# Altium schematic sheet SCH.SchDoc
size B; SheetNumber: 1; SheetTotal: 1
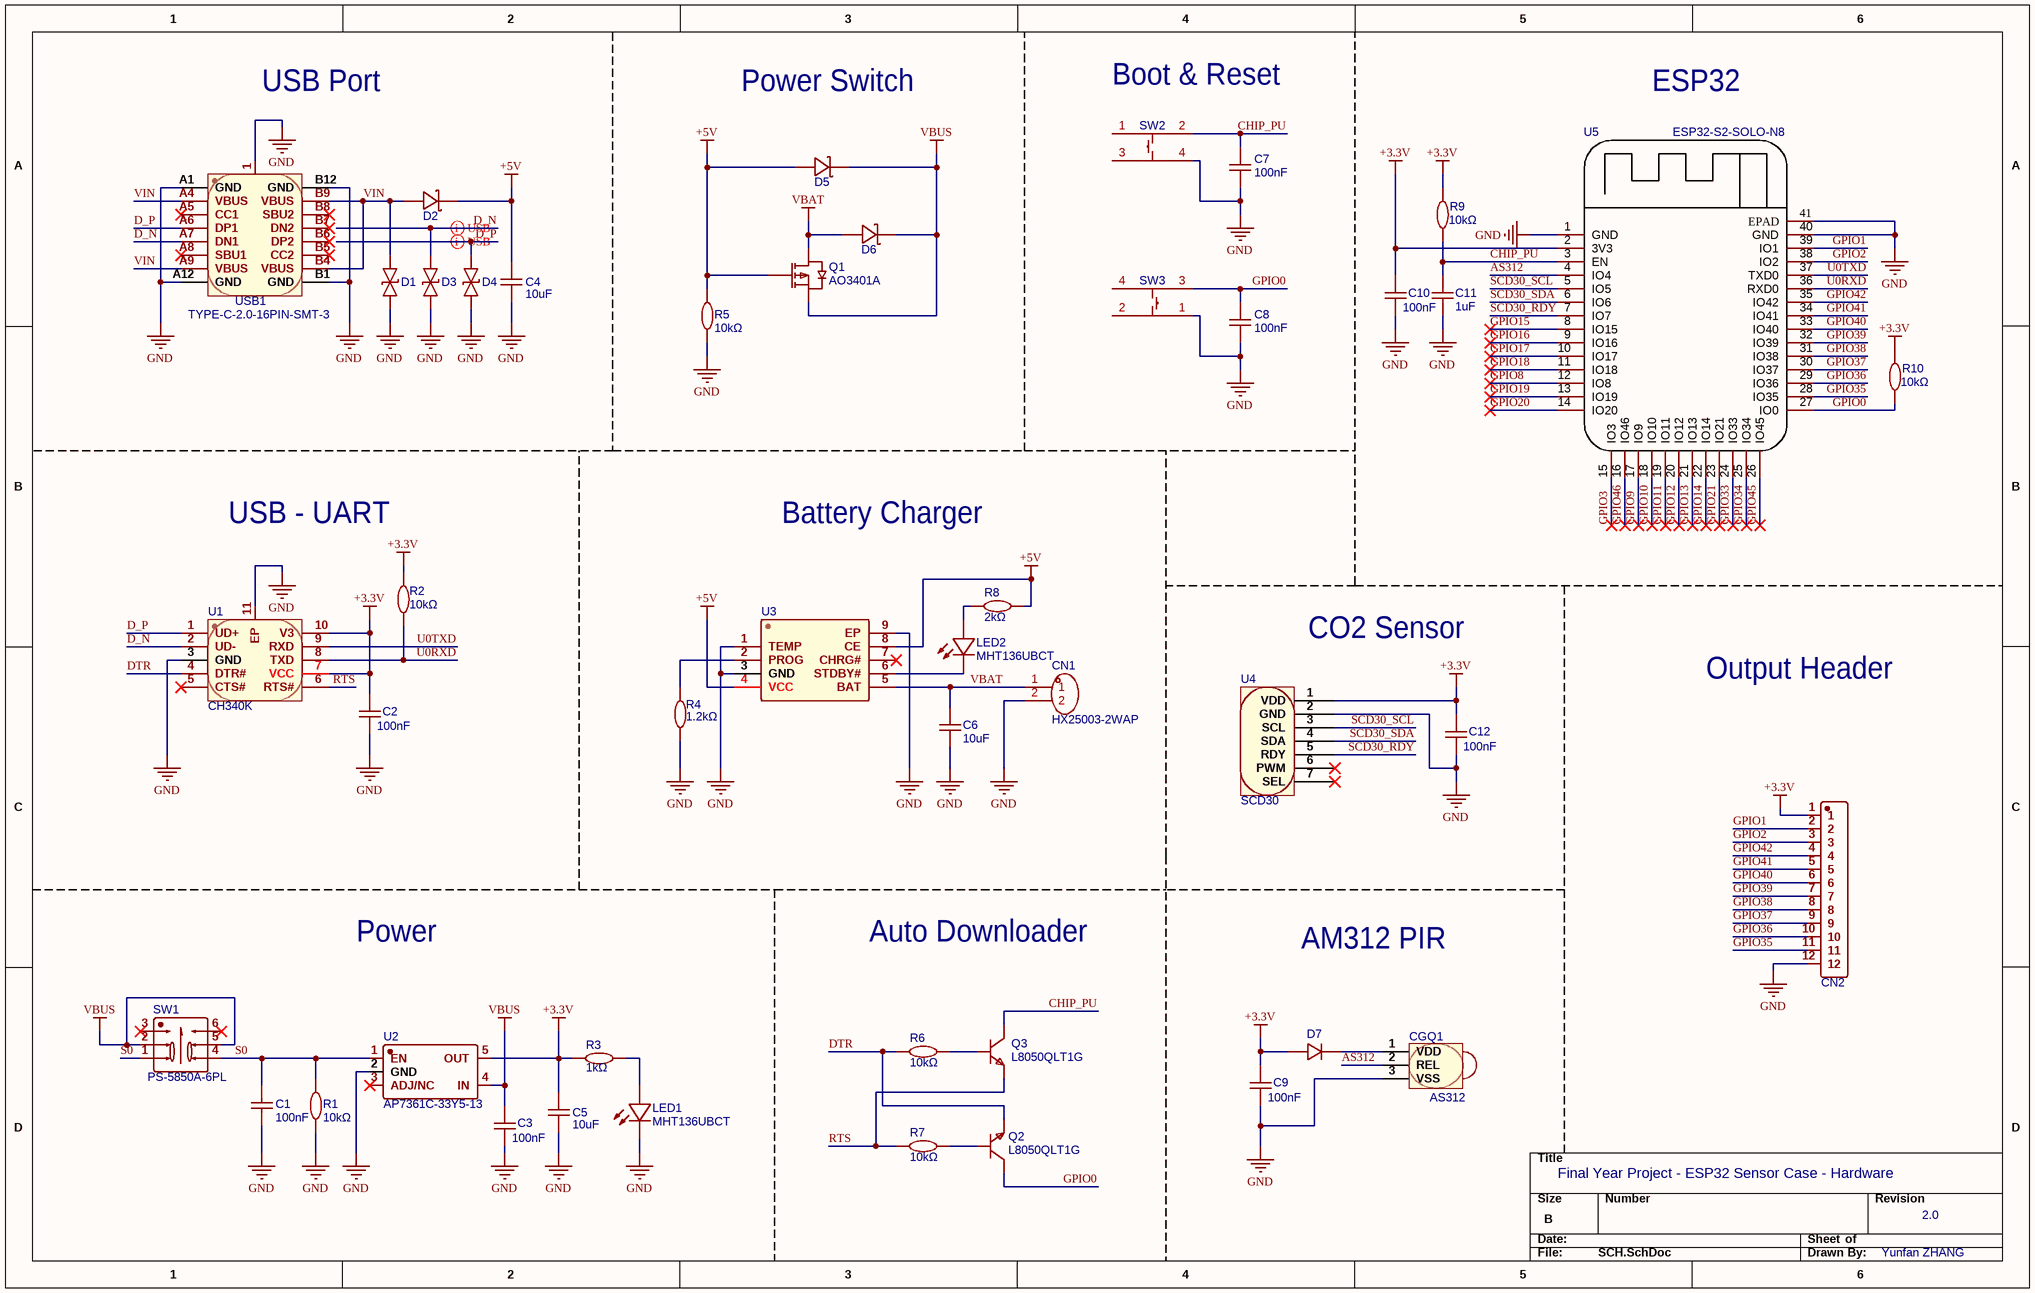
[diagram p0: SCH.SchDoc]

## Parts
C1  100nF  [C0603]
C2  100nF  [C0603]
C3  100nF  [C0603]
C4  10uF  [C0805]
C5  10uF  [C0805]
C6  10uF  [C0805]
C7  100nF  [C0603]
C8  100nF  [C0603]
C9  100nF  [C0603]
C10  100nF  [C0603]
C11  1uF  [C0603]
C12  100nF  [C0603]
CGQ1  AS312  [AS312]
CN1  HX25003-2WAP  [Conn - XH2.54_2P_W]
CN2  X4611WV-12I-C28D40  [Conn - Header_P2.00mm_1*12p_V]  (value not drawn)
D1  LESD5D5.0CT1G  [SOD-523]  (value not drawn)
D2  1N5819HW-7-F  [SOD-123]  (value not drawn)
D3  LESD5D5.0CT1G  [SOD-523]  (value not drawn)
D4  LESD5D5.0CT1G  [SOD-523]  (value not drawn)
D5  1N5819HW-7-F  [SOD-123]  (value not drawn)
D6  1N5819HW-7-F  [SOD-123]  (value not drawn)
D7  CUS08F30,H3F  [SOD-323F]  (value not drawn)
LED1  Name: MHT136UBCT  [LED0402]  (hidden comment: anufacturer Part)
LED2  Name: MHT136UBCT  [LED0402]  (hidden comment: anufacturer Part)
Q1  AO3401A  [SOT-23]
Q2  L8050QLT1G  [SOT-23-3]
Q3  L8050QLT1G  [SOT-23-3]
R1  10kΩ  [R0603]
R2  10kΩ  [R0603]
R3  1kΩ  [R0603]
R4  1.2kΩ  [R0603]
R5  10kΩ  [R0603]
R6  10kΩ  [R0603]
R7  10kΩ  [R0603]
R8  2kΩ  [R0603]
R9  10kΩ  [R0603]
R10  10kΩ  [R0603]
SW1  PS-5850A-6PL  [SW-TH_6P-L5.8-W5.8]
SW2  TD-1150SR-3.8H-250  [SW-PB_SMD_L4.5W4.5]  (value not drawn)
SW3  TD-1150SR-3.8H-250  [SW-PB_SMD_L4.5W4.5]  (value not drawn)
U1  CH340K  [ESOP-10]
U2  AP7361C-33Y5-13  [SOT-89-5]
U3  TP4056  [ESOP-8]  (value not drawn)
U4  SCD30  [SCD30]
U5  ESP32-S2-SOLO-N8  [ESP32-S2-SOLO]
USB1  TYPE-C-2.0-16PIN-SMT-3  [TYPE-C-SMD_TYPE-CF3.1]

## Nets
+3.3V: C2.2 C5.1 C9.2 C10.2 C12.2 CN2.1 D7.2(A) R2.2 R3.1 R9.2 R10.2 U1.7(VCC) U1.10(V3) U2.5(OUT) U4.1(VDD) U5.2(3V3)
+5V: C4.1 D2.2(K) D5.1(A) Q1.1(G) R5.2 R8.2 U3.4(VCC) U3.8(CE)
GND: C1.1 C2.1 C3.1 C4.2 C5.2 C6.1 C7.1 C8.1 C9.1 C10.1 C11.1 C12.1 CGQ1.3(VSS) CN1.2 CN2.12 D1.1 D3.1 D4.1 LED1.1(K) R1.1 R4.1 R5.1 SW2.4 SW3.1 U1.3(GND) U1.11(EP) U2.2(GND) U3.1(TEMP) U3.3(GND) U3.9(EP) U4.2(GND) U5.1(GND) U5.40(GND) U5.41(EPAD) USB1.1(EH) USB1.A1(GND) USB1.A12(GND) USB1.B1(GND) USB1.B12(GND)
VBAT: C6.2 CN1.1 D6.1(A) Q1.3(D) U3.5(BAT)
VBUS: C3.2 D5.2(K) D6.2(K) Q1.2(S) SW1.2 SW1.5 U2.4(IN)
AS312: CGQ1.2(REL) U5.4(IO4)
CHIP_PU: C7.2 C11.2 Q3.3(C) R9.1 SW2.2 U5.3(EN)
D_N: D3.2 U1.2(UD-) USB1.A7(DN1)
D_P: D4.2 U1.1(UD+) USB1.A6(DP1)
DTR: Q2.2(E) R6.1 U1.4(DTR#)
GPIO0: C8.2 Q2.3(C) R10.1 SW3.3 U5.27(IO0)
GPIO1: CN2.2 U5.39(IO1)
GPIO2: CN2.3 U5.38(IO2)
GPIO3: U5.15(IO3)
GPIO8: U5.12(IO8)
GPIO9: U5.17(IO9)
GPIO10: U5.18(IO10)
GPIO11: U5.19(IO11)
GPIO12: U5.20(IO12)
GPIO13: U5.21(IO13)
GPIO14: U5.22(IO14)
GPIO15: U5.8(IO15)
GPIO16: U5.9(IO16)
GPIO17: U5.10(IO17)
GPIO18: U5.11(IO18)
GPIO19: U5.13(IO19)
GPIO20: U5.14(IO20)
GPIO21: U5.23(IO21)
GPIO33: U5.24(IO33)
GPIO34: U5.25(IO34)
GPIO35: CN2.11 U5.28(IO35)
GPIO36: CN2.10 U5.29(IO36)
GPIO37: CN2.9 U5.30(IO37)
GPIO38: CN2.8 U5.31(IO38)
GPIO39: CN2.7 U5.32(IO39)
GPIO40: CN2.6 U5.33(IO40)
GPIO41: CN2.5 U5.34(IO41)
GPIO42: CN2.4 U5.35(IO42)
GPIO45: U5.26(IO45)
GPIO46: U5.16(IO46)
RTS: Q3.2(E) R7.1 U1.6(RTS#)
S0: C1.2 R1.2 SW1.1 SW1.4 U2.1(EN)
SCD30_RDY: U4.5(RDY) U5.7(IO7)
SCD30_SCL: U4.3(SCL) U5.5(IO5)
SCD30_SDA: U4.4(SDA) U5.6(IO6)
U0RXD: R2.1 U1.8(TXD) U5.36(RXD0)
U0TXD: U1.9(RXD) U5.37(TXD0)
VIN: D1.2 D2.1(A) USB1.A4(VBUS) USB1.A9(VBUS) USB1.B4(VBUS) USB1.B9(VBUS)
NetCGQ1_1: CGQ1.1(VDD) D7.1(C)
NetLED1_2: LED1.2(A) R3.2
NetLED2_1: LED2.1(K) U3.6(STDBY#)
NetLED2_2: LED2.2(A) R8.1
NetQ2_1: Q2.1(B) R7.2
NetQ3_1: Q3.1(B) R6.2
NetR4_2: R4.2 U3.2(PROG)

Not connected (* = marked no-connect by the designer): SW1 3* 6*; SW2 1 3; SW3 2 4; U1 5(CTS#)*; U2 3(ADJ/NC)*; U3 7(CHRG#)*; U4 6(PWM)* 7(SEL)*; USB1 A5(CC1)* A8(SBU1)* B5(CC2)* B6(DP2)* B7(DN2)* B8(SBU2)*

## Layout directives
differential pair: D_N, D_P

## Notes on the sheet
- USB Port
- Power Switch
- (near SW2) Boot & Reset
- ESP32
- USB - UART
- Battery Charger
- CO2 Sensor
- Output Header
- Power
- Auto Downloader
- AM312 PIR
- Final Year Project - ESP32 Sensor Case - Hardware
- 2.0
- Yunfan ZHANG

## Library data of the parts
C1-C3 C7-C10 C12 = C 100nF 0603 - CC0603KRX7R9BB104: 容值:100nF;精度:±10%;额定电压:50V;材质(温度系数):X7R;; Manufacturer: YAGEO(国巨); Add into BOM: yes; Tolerance: ±10%; Voltage Rated: 50V; Temperature Coefficient: X7R; Symbol: CC0603KRX7R9BB104; Device: CC0603KRX7R9BB104; LCSC Part Name: 100nF ±10% 50V; Supplier Part: C14663; Manufacturer Part: CC0603KRX7R9BB104; Supplier Footprint: 0603; JLCPCB Part Class: Basic Part; Datasheet: https://atta.szlcsc.com/upload/public/pdf/source/20170116/1484561234239.pdf; Supplier: LCSC; Convert to PCB: yes; Value: 100nF
  C2 C3 C9 C10 C12: Name: 100nF
C4-C6 = C 10uF 0805 - CC0805KKX5R8BB106: 容值:10uF;精度:±10%;额定电压:25V;材质(温度系数):X5R;; Manufacturer: YAGEO(国巨); Symbol: CC0805KKX5R8BB106_C694803; Add into BOM: yes; Tolerance: ±10%; Voltage Rated: 25V; Temperature Coefficient: X5R; Device: CC0805KKX5R8BB106; LCSC Part Name: 10uF ±10% 25V; Supplier Part: C694803; Manufacturer Part: CC0805KKX5R8BB106; Supplier Footprint: 0805; JLCPCB Part Class: Extended Part; Datasheet: https://atta.szlcsc.com/upload/public/pdf/source/20200629/C694803_9DB3A764988BBFF394BBC6FE6146EEC3.pdf; Supplier: LCSC; Convert to PCB: yes; Value: 10uF
  C4 C5: Name: 10uF
C11 = C 1uF 0603 - CC0603KRX5R8BB105: 容值:1uF;精度:±10%;额定电压:25V;材质(温度系数):X5R;; Manufacturer: YAGEO(国巨); Add into BOM: yes; Tolerance: ±10%; Voltage Rated: 25V; Temperature Coefficient: X5R; Symbol: CC0603KRX5R8BB105; Device: CC0603KRX5R8BB105; LCSC Part Name: 1uF ±10% 25V; Supplier Part: C14664; Manufacturer Part: CC0603KRX5R8BB105; Supplier Footprint: 0603; JLCPCB Part Class: Extended Part; Datasheet: https://atta.szlcsc.com/upload/public/pdf/source/20160606/1465200209684.pdf; Supplier: LCSC; Convert to PCB: yes; Value: 1uF; Name: 1uF
CGQ1 = AS312: 直接数字信号输出智能人体热释电红外传感器; Manufacturer: 森霸; Add into BOM: yes; Symbol: AS312; Device: AS312; LCSC Part Name: AS312; Supplier Part: C90465; Manufacturer Part: AS312; Supplier Footprint: Through Hole; JLCPCB Part Class: Extended Part; Datasheet: https://atta.szlcsc.com/upload/public/pdf/source/20200426/C410378_E662E343D148296728FA1A532A92CD1E.pdf; Supplier: LCSC; Convert to PCB: yes
CN1 = Conn - XH2.54_2P: 参考系列:XH;间距:2.5mm;插针结构:1x2P;排数:1;每排PIN数:2;行距:-;公母:公型插针;安装方式:弯插;额定电流:-;工作温度范围:-;; Manufacturer: HX(红星); Add into BOM: yes; Reference Series: XH; Pitch: 2.5mm; Pins Structure: 1x2P; Number of PINs Per Row: 2; Gender: 公型插针; Symbol: HX25003-2WAP; Device: HX25003-2WAP; LCSC Part Name: 母座 弯插/弯针 2.5mm 2Pin位; Supplier Part: C442326; Manufacturer Part: HX25003-2WAP; Supplier Footprint: 插件,P=2.5mm; JLCPCB Part Class: Extended Part; Datasheet: https://atta.szlcsc.com/upload/public/pdf/source/20191028/C442326_951D1FF48F4BC139C99E649B2A876D28.pdf; Supplier: LCSC; Convert to PCB: yes; Number of Rows: 1; Row Spacing: -; Mounting Style: 弯插; Current Rating (Max): -; Operating Temperature Range: -
CN2 = Conn - Header_P2.00mm_1*12p: 间距:2mm;总PIN位数:12;排数:1;插针结构:1x12P;行距:-;安装类型:直插;圆针/方针:方针;额定电流:3A;额定电压:250V;配合针长度:4mm;塑高:2mm;端接针长度:2.8mm;触头材质:黄铜;触头镀层:金;工作温度范围:-40~+105;焊接温度(最大值):260;颜色:黑色;; Manufacturer: XKB Connectivity(中国星坤); Add into BOM: yes; Pitch: 2mm; Pin Structure: 1x12P; Circluar Pins/Square Pins: 方针; Current Rating (Max): 3A; Voltage Rating (Max): 250V; Welding Temperature (Max): 260; Symbol: X4611WV-12I-C28D40; Device: X4611WV-12I-C28D40; LCSC Part Name: 2mm 1x12P 直插 方针; Supplier Part: C2882986; Manufacturer Part: X4611WV-12I-C28D40; Supplier Footprint: 插件,P=2mm; JLCPCB Part Class: Extended Part; Datasheet: https://atta.szlcsc.com/upload/public/pdf/source/20211011/3B1C644FF3C000A91027C44B177FF3A1.pdf; Supplier: LCSC; Convert to PCB: yes; Number of Pins: 12; Number of Rows: 1; Row Spacing: -; Mounting Type: 直插; Length of Mating Pin: 4mm; Insulation Height: 2mm; Length of End Connection Pin: 2.8mm; Contact Material: 黄铜; Contact Plating: 金; Operating Temperature Range: -40~+105; Color: 黑色; Name: X4611WV-12I-C28D40
D1 D3 D4 = D - LESD5D5.0CT1G: 极性:Bidirectional;反向关断电压（典型值）:5V;击穿电压（最小值）:5.6V;箝位电压:18.6V;峰值脉冲电流（10/1000us）:9.4A (8/20us);; Manufacturer: LRC(乐山无线电); Add into BOM: yes; Voltage - Reverse Standoff (Typ): 5V; Voltage - Breakdown (Min): 5.6V; Voltage - Clamping (Max) @ Ipp: 18.6V; Name: LESD5D5.0CT1G; Symbol: LESD5D5.0CT1G; Device: LESD5D5.0CT1G; LCSC Part Name: LESD5D5.0CT1G; Supplier Part: C383211; Manufacturer Part: LESD5D5.0CT1G; Supplier Footprint: SOD-523; JLCPCB Part Class: Extended Part; Datasheet: https://atta.szlcsc.com/upload/public/pdf/source/20190807/C383211_633DF4B4E2C161403226E5235FE33A1C.pdf; Supplier: LCSC; Convert to PCB: yes; Polarity: Bidirectional; Current - Peak Pulse (10/1000μs): 9.4A (8/20us)
D2 D5 D6 = D - 1N5819HW-7-F: 直流反向耐压(Vr):40V;平均整流电流(Io):1A;正向压降(Vf):450mV@1A;; Manufacturer: DIODES(美台); Add into BOM: yes; Reverse Voltage (Vr): 40V; Average Rectified Current (Io): 1A; Name: 1N5819HW-7-F; Symbol: 1N5819HW-7-F; Device: 1N5819HW-7-F; LCSC Part Name: 40V 1A 450mV@1A; Supplier Part: C82544; Manufacturer Part: 1N5819HW-7-F; Supplier Footprint: SOD-123; JLCPCB Part Class: Extended Part; Datasheet: https://atta.szlcsc.com/upload/public/pdf/source/20161024/1477288459223.pdf; Supplier: LCSC; Convert to PCB: yes; Forward Voltage (Vf@If): 450mV@1A
D7 = D - CUS08F30,H3F: 直流反向耐压(Vr):30V;平均整流电流(Io):800mA;正向压降(Vf):220mV@10mA;; Manufacturer: TOSHIBA(东芝); Add into BOM: yes; Reverse Voltage (Vr): 30V; Average Rectified Current (Io): 800mA; Name: CUS08F30,H3F; Symbol: CUS08F30,H3F; Device: CUS08F30,H3F; LCSC Part Name: 30V 800mA 220mV@10mA; Supplier Part: C150183; Manufacturer Part: CUS08F30,H3F; Supplier Footprint: SOD-323; JLCPCB Part Class: Extended Part; Datasheet: https://atta.szlcsc.com/upload/public/pdf/source/20180126/C150183_15169561730551309331.pdf; Supplier: LCSC; Convert to PCB: yes; Forward Voltage (Vf@If): 220mV@10mA
LED1 LED2 = LED - MHT136UBCT: 发光颜色:蓝灯;二极管配置:-;透镜颜色:无色透明;主波长:460nm~475nm;峰值波长:468nm;色温:-;光通量(25时):-;测试电流:5mA;正向电压(VF):3V;发光强度:72mcd;功率:95mW;发光角度:120°;安装方式:-;工作温度:-35~+85;; Manufacturer: MEIHUA(美华); Add into BOM: yes; Emitted Color: 蓝灯; Lens Color: 无色透明; Peak Wavelength: 468nm; Forward Current: 5mA; Forward Voltage (VF): 3V; Luminous Intensity: 72mcd; Power Dissipation: 95mW; Viewing Angle: 120°; Symbol: MHT136UBCT; Device: MHT136UBCT; LCSC Part Name: 0402正贴蓝色光0.3T; Supplier Part: C401112; Manufacturer Part: MHT136UBCT; Supplier Footprint: 0402; JLCPCB Part Class: Extended Part; Datasheet: https://atta.szlcsc.com/upload/public/pdf/source/20190702/C401112_5DC3FC64C29106EB5A730797BBB1C3EC.pdf; Supplier: LCSC; Convert to PCB: yes; Diode Configuration: -; Dominant Wavelength: 460nm~475nm; Color Temperature: -; Luminous Flux (@25℃): -; Mounting Sytle: -; Operating Temperature: -35~+85
Q1 = PMOS - AO3401A_C15127: 类型:P沟道;漏源电压(Vdss):30V;连续漏极电流(Id):4A;功率(Pd):1.4W;导通电阻(RDS(on)@Vgs,Id):44mΩ@10V,4.3A;阈值电压(Vgs(th)@Id):1.3V@250A;; Manufacturer: AOS; Add into BOM: yes; Type: P沟道; Drain Source Voltage (Vdss): 30V; Continuous Drain Current (Id): 4A; Power Dissipation (Pd): 1.4W; Symbol: AO3401A; Device: AO3401A_C15127; LCSC Part Name: P沟道 30V 4A; Supplier Part: C15127; Manufacturer Part: AO3401A; Supplier Footprint: SOT-23-3L; JLCPCB Part Class: Basic Part; Datasheet: https://atta.szlcsc.com/upload/public/pdf/source/20160507/1462613609053.pdf; Supplier: LCSC; Convert to PCB: yes; Drain Source On Resistance (RDS(on)@Vgs,Id): 44mΩ@10V,4.3A; Gate Threshold Voltage (Vgs(th)@Id): 1.3V@250A; Name: AO3401A
Q2 Q3 = NPN - L8050QLT1G: 晶体管类型:NPN;集射极击穿电压(Vceo):25V;集电极电流(Ic):800mA;功率(Pd):225mW;; Manufacturer: LRC(乐山无线电); Add into BOM: yes; Transistor Type: NPN; Collector-Emitter Breakdown Voltage (Vceo): 25V; Collector Current (Ic): 800mA; Power Dissipation (Pd): 225mW; NAME: E; NUMBER: 2; Symbol: L8050QLT1G; Device: L8050QLT1G; LCSC Part Name: L8050QLT1G; Supplier Part: C49581; Manufacturer Part: L8050QLT1G; Supplier Footprint: SOT-23(SOT-23-3); JLCPCB Part Class: Extended Part; Datasheet: https://atta.szlcsc.com/upload/public/pdf/source/20150518/1457707314424.pdf; Supplier: LCSC; Convert to PCB: yes; Name: L8050QLT1G
R1 R2 R5-R7 R9 R10 = R 10K 0603 - AC0603FR-0710KL: 电阻类型:厚膜电阻;阻值:10kΩ;精度:±1%;功率:100mW;温度系数:±100ppm/;最大工作电压:75V;工作温度范围:-55~+155;; Manufacturer: YAGEO(国巨); Add into BOM: yes; Tolerance: ±1%; Power(Watts): 100mW; Overload Voltage (Max): 75V; Symbol: AC0603FR-0710KL; Device: AC0603FR-0710KL; LCSC Part Name: 10kΩ ±1% 100mW; Supplier Part: C116677; Manufacturer Part: AC0603FR-0710KL; Supplier Footprint: 0603; JLCPCB Part Class: Extended Part; Datasheet: https://atta.szlcsc.com/upload/public/pdf/source/20171106/C116677_15099694143531094015.pdf; Supplier: LCSC; Convert to PCB: yes; Type: 厚膜电阻; Value: 10kΩ; Temperature Coefficient: ±100ppm/; Operating Temperature Range: -55~+155
R3 = R 1K 0603 - RC0603DR-071KL: 电阻类型:厚膜电阻;阻值:1kΩ;精度:±0.5%;功率:100mW;温度系数:±100ppm/;最大工作电压:75V;工作温度范围:-55~+155;; Manufacturer: YAGEO(国巨); Add into BOM: yes; Tolerance: ±0.5%; Power(Watts): 100mW; Overload Voltage (Max): 75V; Symbol: RC0603DR-071KL; Device: RC0603DR-071KL; LCSC Part Name: 1kΩ ±0.5%; Supplier Part: C100050; Manufacturer Part: RC0603DR-071KL; Supplier Footprint: 0603; JLCPCB Part Class: Extended Part; Datasheet: https://atta.szlcsc.com/upload/public/pdf/source/20171225/C100050_15141877822481202732.pdf; Supplier: LCSC; Convert to PCB: yes; Type: 厚膜电阻; Value: 1kΩ; Temperature Coefficient: ±100ppm/; Operating Temperature Range: -55~+155
R4 = R 1.2K 0603 - RC0603FR-071K2L: 电阻类型:厚膜电阻;阻值:1.2kΩ;精度:±1%;功率:100mW;温度系数:±100ppm/;最大工作电压:75V;工作温度范围:-55~+155;; Manufacturer: YAGEO(国巨); Add into BOM: yes; Tolerance: ±1%; Power(Watts): 100mW; Overload Voltage (Max): 75V; Symbol: RC0603FR-071K2L; Device: RC0603FR-071K2L; LCSC Part Name: 1.2kΩ ±1% 100mW; Supplier Part: C114605; Manufacturer Part: RC0603FR-071K2L; Supplier Footprint: 0603; JLCPCB Part Class: Extended Part; Datasheet: https://atta.szlcsc.com/upload/public/pdf/source/20170912/C114605_1505207784050963429.pdf; Supplier: LCSC; Convert to PCB: yes; Type: 厚膜电阻; Value: 1.2kΩ; Temperature Coefficient: ±100ppm/; Operating Temperature Range: -55~+155
R8 = R 2K 0603 - RC0603FR-072KL: 精度:±1%;阻值:2kΩ;温度系数:±100ppm/;功率:100mW;最大工作电压:75V;工作温度范围:-55~+155;; Manufacturer: YAGEO(国巨); Add into BOM: yes; Tolerance: ±1%; Power(Watts): 100mW; Overload Voltage (Max): 75V; Symbol: RC0603FR-072KL; Device: RC0603FR-072KL; LCSC Part Name: 2kΩ ±1%; Supplier Part: C105576; Manufacturer Part: RC0603FR-072KL; Supplier Footprint: 0603; JLCPCB Part Class: Extended Part; Datasheet: https://atta.szlcsc.com/upload/public/pdf/source/20170428/1493376739276.pdf; Supplier: LCSC; Convert to PCB: yes; Value: 2kΩ; Temperature Coefficient: ±100ppm/; Operating Temperature Range: -55~+155
SW1 = SW - PS-5850A-6PL: 5.8自锁按键开关 高头 耐高温; Manufacturer: G-Switch(品赞); Add into BOM: yes; Symbol: PS-5850A-6PL; Device: PS-5850A-6PL; LCSC Part Name: 自锁按键开关; Supplier Part: C963201; Manufacturer Part: PS-5850A-6PL; Supplier Footprint: 插件,5.8x5.8x10mm; JLCPCB Part Class: Extended Part; Datasheet: https://atta.szlcsc.com/upload/public/pdf/source/20201201/C963201_9229C247AC907A82E381B4EE0BC1DEDE.pdf; Supplier: LCSC; Convert to PCB: yes
SW2 SW3 = SW - TD-1150SR-3.8H-250: 电路结构:单刀单掷;安装方式:立贴;按钮形状:圆形按钮;按钮/盖帽颜色:黑色;作用力:250gf@±50gf;引脚样式:鸥翼型;开关长度:4.5mm;开关宽度:4.5mm;开关高度:3.8mm;带支架:否;; Manufacturer: DEALON(德艺隆); Add into BOM: yes; Circuit: 单刀单掷; Actuator Style: 圆形按钮; Actuator/Cap Color: 黑色; Pin Style: 鸥翼型; Switch Length: 4.5mm; Switch Height: 3.8mm; Strike Gundam: 否; Name: TD-1150SR-3.8H-250; Symbol: TD-1150SR-3.8H-250; Device: TD-1150SR-3.8H-250; LCSC Part Name: 4.5立贴轻触开关250gf; Supplier Part: C2905105; Manufacturer Part: TD-1150SR-3.8H-250; Supplier Footprint: SMD; JLCPCB Part Class: Extended Part; Datasheet: https://atta.szlcsc.com/upload/public/pdf/source/20211025/82E225C9C8408DC892CD53CB5698F3D1.pdf; Supplier: LCSC; Convert to PCB: yes; Mounting Style: 立贴; Operating Force: 250gf@±50gf; Switch Width: 4.5mm
U1 = CH340K: 类型:-;协议类别:-;驱动器/接收器数:-;数据速率:-;; Manufacturer: WCH(南京沁恒); Add into BOM: yes; Symbol: CH340K; Device: CH340K; LCSC Part Name: CH340K; Supplier Part: C968586; Manufacturer Part: CH340K; Supplier Footprint: ESSOP-10; JLCPCB Part Class: Extended Part; Datasheet: https://atta.szlcsc.com/upload/public/pdf/source/20200819/C84681_ADBED554CE321879DBD6B1D06488689C.pdf; Supplier: LCSC; Convert to PCB: yes; Type: -; Protocol: -; Number of Drivers/Receivers: -; Data Rate: -; Supply Voltage: -
U2 = AP7361C-33Y5-13: 输出类型:固定;输出极性:正;输出通道数:1;最大输入电压:6V;输出电压:3.3V;压差:360mV@(1A);输出电流:1A;电源纹波抑制比(PRSS):75dB@(1kHz),55dB@(10kHz);; Manufacturer: DIODES(美台); Add into BOM: yes; Output Type: 固定; Output Polarity: 正; Number of Outputs: 1; Maximum Input Voltage: 6V; Output Voltage: 3.3V; Symbol: AP7361C-33Y5-13; Device: AP7361C-33Y5-13; LCSC Part Name: Vin=6V Vout=3.3V 1A 75dB@(1kHz),55dB@(10kHz); Supplier Part: C460397; Manufacturer Part: AP7361C-33Y5-13; Supplier Footprint: SOT-89-5; JLCPCB Part Class: Extended Part; Datasheet: https://atta.szlcsc.com/upload/public/pdf/source/20191127/C460397_F4F6F327541BE4867462406DC5457012.pdf; Supplier: LCSC; Convert to PCB: yes; Dropout Voltage: 360mV@(1A); Output Current: 1A; Power Supply Rejection Ratio (PRSS): 75dB@(1kHz),55dB@(10kHz)
U3 = TP4056: Manufacturer: UMW(友台半导体); Symbol: TP4056_C725790; Add into BOM: yes; Device: TP4056_C725790; LCSC Part Name: TP4056; Supplier Part: C725790; Manufacturer Part: TP4056; Supplier Footprint: ESOP-8; JLCPCB Part Class: Extended Part; Datasheet: https://atta.szlcsc.com/upload/public/pdf/source/20211011/37515E71BA298E23D23475482C49633D.pdf; Supplier: LCSC; Convert to PCB: yes
U4 = SCD30: SEL: Pull to VDD - ModBus | Down to GND - I2C
U5 = ESP32-S2-SOLO-N8: Manufacturer: ESPRESSIF 乐鑫; Add into BOM: yes; Symbol: ESP32-S2-SOLO-N8; Device: ESP32-S2-SOLO-N8; LCSC Part Name: ESP32-S2-SOLO-N8; Supplier Part: C2980303; Manufacturer Part: ESP32-S2-SOLO-N8; Supplier Footprint: -; JLCPCB Part Class: Extended Part; Datasheet: https://atta.szlcsc.comnull; Supplier: LCSC; Convert to PCB: yes; Name: ESP32-S2-SOLO-N8
USB1 = USB - TYPE-C-2.0-16PIN-SMT-3: 连接器类型:Type-C;标准:USB 2.0;公母:母座;触点数量:16;端口数量:1;安装方式:卧贴;额定电流 - 电源:3A;工作温度范围:-40~+85;; Manufacturer: CIKI(皓富); Add into BOM: yes; Connector Type: Type-C; Gender: 母座; Number of Contacts: 16; Number of Ports: 1; Current Rating - Power (Max): 3A; Symbol: TYPE-C-2.0-16PIN-SMT-3; Device: TYPE-C-2.0-16PIN-SMT-3; LCSC Part Name: Type-C 母座 卧贴; Supplier Part: C2987386; Manufacturer Part: TYPE-C-2.0-16PIN-SMT-3; Supplier Footprint: SMD; JLCPCB Part Class: Extended Part; Datasheet: https://atta.szlcsc.com/upload/public/pdf/source/20220407/B142FF2CEB5FE873AECDBA4AD709657C.pdf; Supplier: LCSC; Convert to PCB: yes; Standard: USB 2.0; Mounting Style: 卧贴; Operating Temperature Range: -40~+85; Name: TYPE-C-2.0-16PIN-SMT-3